# Altium schematic sheet Fan.SchDoc
size A4
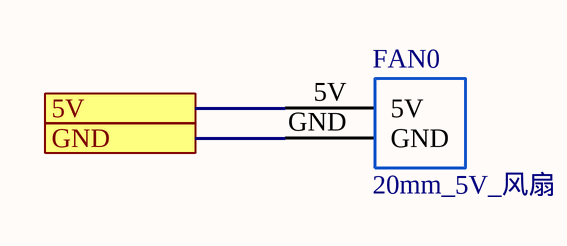
[diagram p0: Fan.SchDoc]

## Parts
FAN0  20mm_5V_风扇  [20mmFAN]

## Ports
5V, GND

## Nets
5V: FAN0.5V ; port 5V
GND: FAN0.GND ; port GND

## Library data of the parts
FAN0 = 20mmFAN: pin to pad: 5V>7 GND>6